# Altium schematic sheet I2C DP Sensor 2.SchDoc: Delta Pressure Sensor 2
size 292 x 193 mm; SheetNumber: 15; SheetTotal: 40
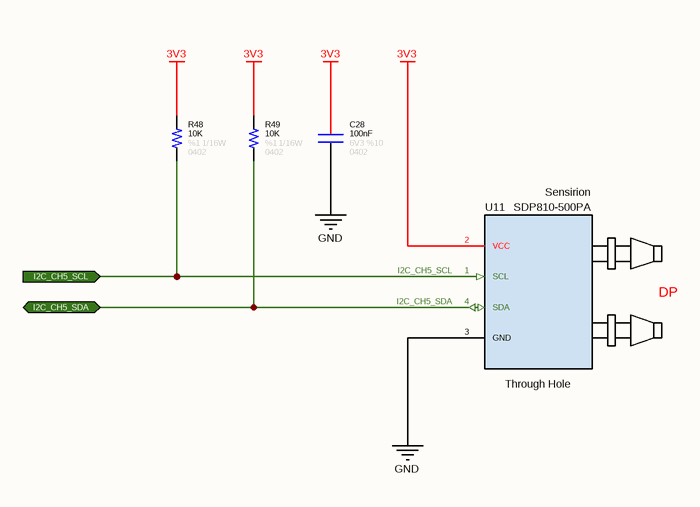
[diagram p0: I2C DP Sensor 2.SchDoc]

## Parts
C28  value 100nF  Tolerance: %10  Voltage: 6V3  Case: 0402  [CAPACITOR_0402]  (hidden comment: Capacitor - 100nF [0402] (Ceramic))
R48  value 10K  Tolerance: %1  Case: 0402  Power: 1/16W  [RESISTOR_0402]  (hidden comment: 10K - 0402 - %1 - 1/16W)
R49  value 10K  Tolerance: %1  Case: 0402  Power: 1/16W  [RESISTOR_0402]  (hidden comment: 10K - 0402 - %1 - 1/16W)
U11  Manufacturer Name: Sensirion  Case: Through Hole  [SDP810-500PA]  (hidden comment: SDP810-500PA)

## Ports
I2C_CH5_SCL (in), I2C_CH5_SDA (bidir)

## Nets
3V3: C28.2 R48.2 R49.2 U11.2(VCC)
GND: C28.1 U11.3(GND)
I2C_CH5_SCL: R48.1 U11.1(SCL) ; port I2C_CH5_SCL
I2C_CH5_SDA: R49.1 U11.4(SDA) ; port I2C_CH5_SDA

## Notes on the sheet
- © 2021 All rights reserved.
  This document may not, in whole or in part, be copied, photocopied, reproduced, translated or converted to any electronic or machine readable from without prior written permission of Mehmet Günce Akkoyun.
  Engineer contact : akkoyun@me.com
- Property of
- Engineer :
- Date :
- Size :
- A4
- Time :
- Project :
- Page :
- /
- Customer :
- Product ID :
- Module ID :
- Version :
- File :
- Revision :
- (in symbol IC - SDP810-500PA) DP

## Library data of the parts
C28 = Capacitor - 100nF [0402-6V3]: Capacitor - 100nF [0402-6V3] (Ceramic); Manufacturer Name: AVX; Manufacturer Part Number: 04026D104KAT4A; ComponentLink1Description: Mouser; ComponentLink1URL: https://www.mouser.com.tr/ProductDetail/AVX/04026D104KAT4A?qs=sGAEpiMZZMs0AnBnWHyRQPg4iYkCw7IMED%2F4kpqgf7w%3D; ComponentLink2Description: DataSheet; ComponentLink2URL: https://www.mouser.com.tr/datasheet/2/40/cx5r-776519.pdf
R48 R49 = Resistor - 10K [0402]: Thick Film Resistors - SMD 1/16 W 10 KOhm 1%; Manufacturer Name: Vishay; Manufacturer Part Number: CRCW040210K0FKED; ComponentLink1Description: DataSheet; ComponentLink1URL: https://www.mouser.com.tr/datasheet/2/427/dcrcwe3-1762152.pdf; ComponentLink2Description: Mouser; ComponentLink2URL: https://www.mouser.com.tr/ProductDetail/Vishay-Dale/CRCW040210K0FKED?qs=sGAEpiMZZMu61qfTUdNhG2DpbjADlD3GcalbOv9utCY%3D
U11 = IC - SDP810-500PA: Board Mount Pressure Sensors Tube Connection, I2C , 500Pa; Operating Pressure: - 500 Pa to 500 Pa; Accuracy: 3 %; RoHS: Yes; Product Type: Differential Pressure Sensors; Manufacturer Part Number: SDP810-500PA